# EAGLE design PowerBrickBoard (EAGLE 9.2.0)
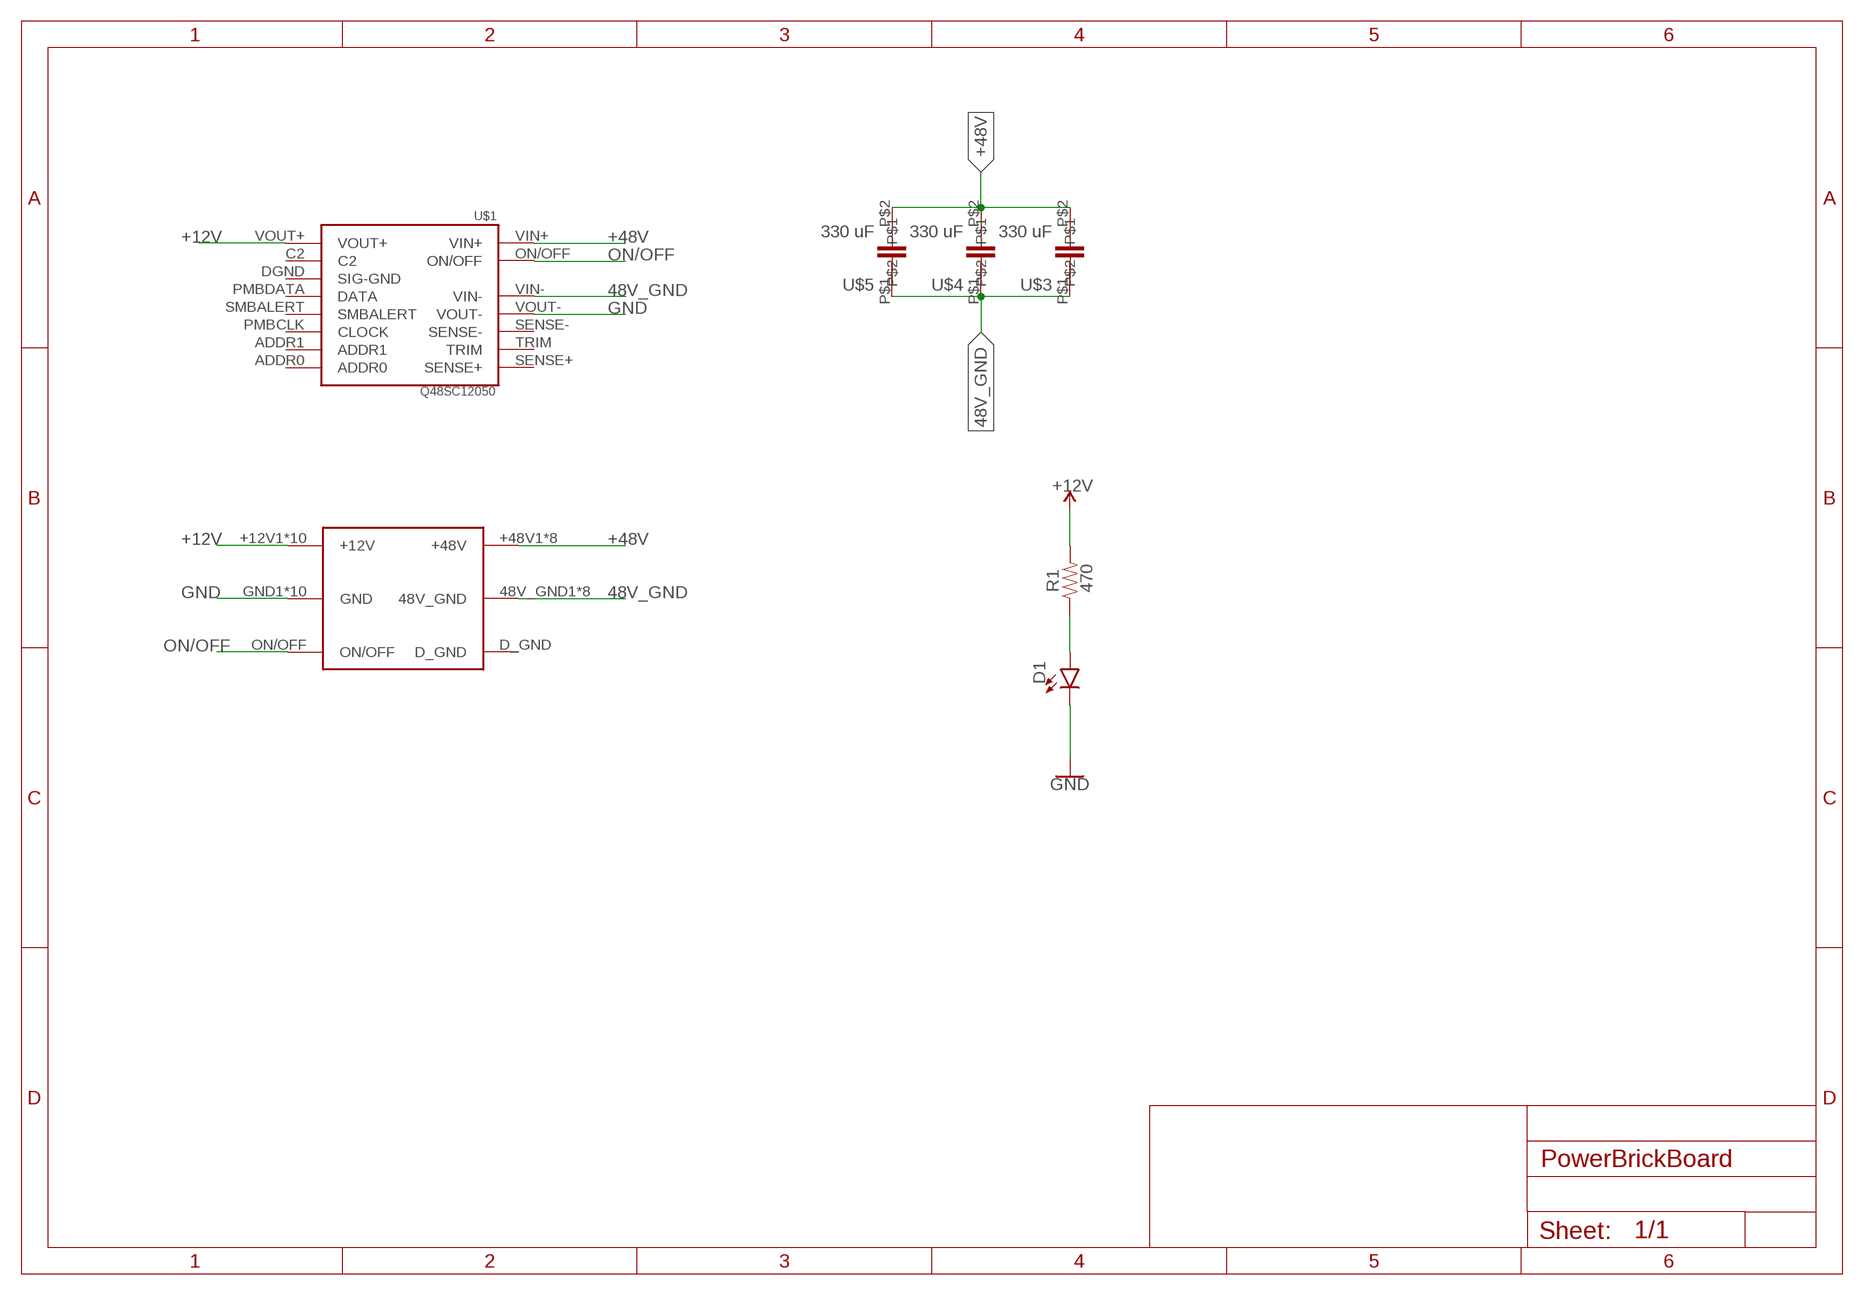
[diagram p0: schematic, sheet 1]

## Parts
D1  LED0603  [LED-0603]
R1  470  RESISTOR0603  [0603]
U$1  Q48SC12050  [Q48SC12050]
U$2  BRICK_TO_POWER_DIST_WHOLE  [BRICK_TO_POWER_DIST_WHOLE]
U$3  330 uF  UCM1H331MNL1GS  [UCM1H331MNL1GS]
U$4  330 uF  UCM1H331MNL1GS  [UCM1H331MNL1GS]
U$5  330 uF  UCM1H331MNL1GS  [UCM1H331MNL1GS]

## Nets
48V_GND: U$1.VIN- U$2.48V_GND1(48V_GND) U$2.48V_GND2(48V_GND) U$2.48V_GND3(48V_GND) U$2.48V_GND4(48V_GND) U$2.48V_GND5(48V_GND) U$2.48V_GND6(48V_GND) U$2.48V_GND7(48V_GND) U$2.48V_GND8(48V_GND) U$3.P$1 U$4.P$1 U$5.P$1
+12V: R1.2 U$1.VOUT+ U$2.+12V1(+12V) U$2.+12V2(+12V) U$2.+12V3(+12V) U$2.+12V4(+12V) U$2.+12V5(+12V) U$2.+12V6(+12V) U$2.+12V7(+12V) U$2.+12V8(+12V) U$2.+12V9(+12V) U$2.+12V10(+12V)
+48V: U$1.VIN+ U$2.+48V1(+48V) U$2.+48V2(+48V) U$2.+48V3(+48V) U$2.+48V4(+48V) U$2.+48V5(+48V) U$2.+48V6(+48V) U$2.+48V7(+48V) U$2.+48V8(+48V) U$3.P$2 U$4.P$2 U$5.P$2
D_GND: U$1.DGND(SIG-GND)
GND: D1.C U$1.VOUT- U$2.GND1(GND) U$2.GND2(GND) U$2.GND3(GND) U$2.GND4(GND) U$2.GND5(GND) U$2.GND6(GND) U$2.GND7(GND) U$2.GND8(GND) U$2.GND9(GND) U$2.GND10(GND)
N$1: D1.A R1.1
ON/OFF: U$1.ON/OFF U$2.ON/OFF
Unconnected: U$1.ADDR0 U$1.ADDR1 U$1.C2 U$1.PMBCLK(CLOCK) U$1.PMBDATA(DATA) U$1.SENSE+ U$1.SENSE- U$1.SMBALERT U$1.TRIM U$2.D_GND

## Library data of the parts
D1 = SparkFun-LED:LED: LED (Generic) Standard schematic elements and footprints for 5mm, 3mm, 1206, and 0603 sized LEDs. Generic LEDs with no color specified.
R1 = SparkFun-Resistors:RESISTOR: Generic Resistor Package
U$1 = Q48SC12050:Q48SC12050
U$2 = PDB_TO_BRICKS:BRICK_TO_POWER_DIST_WHOLE
U$3-U$5 = UCM1H331MNL1GS:UCM1H331MNL1GS

## Board
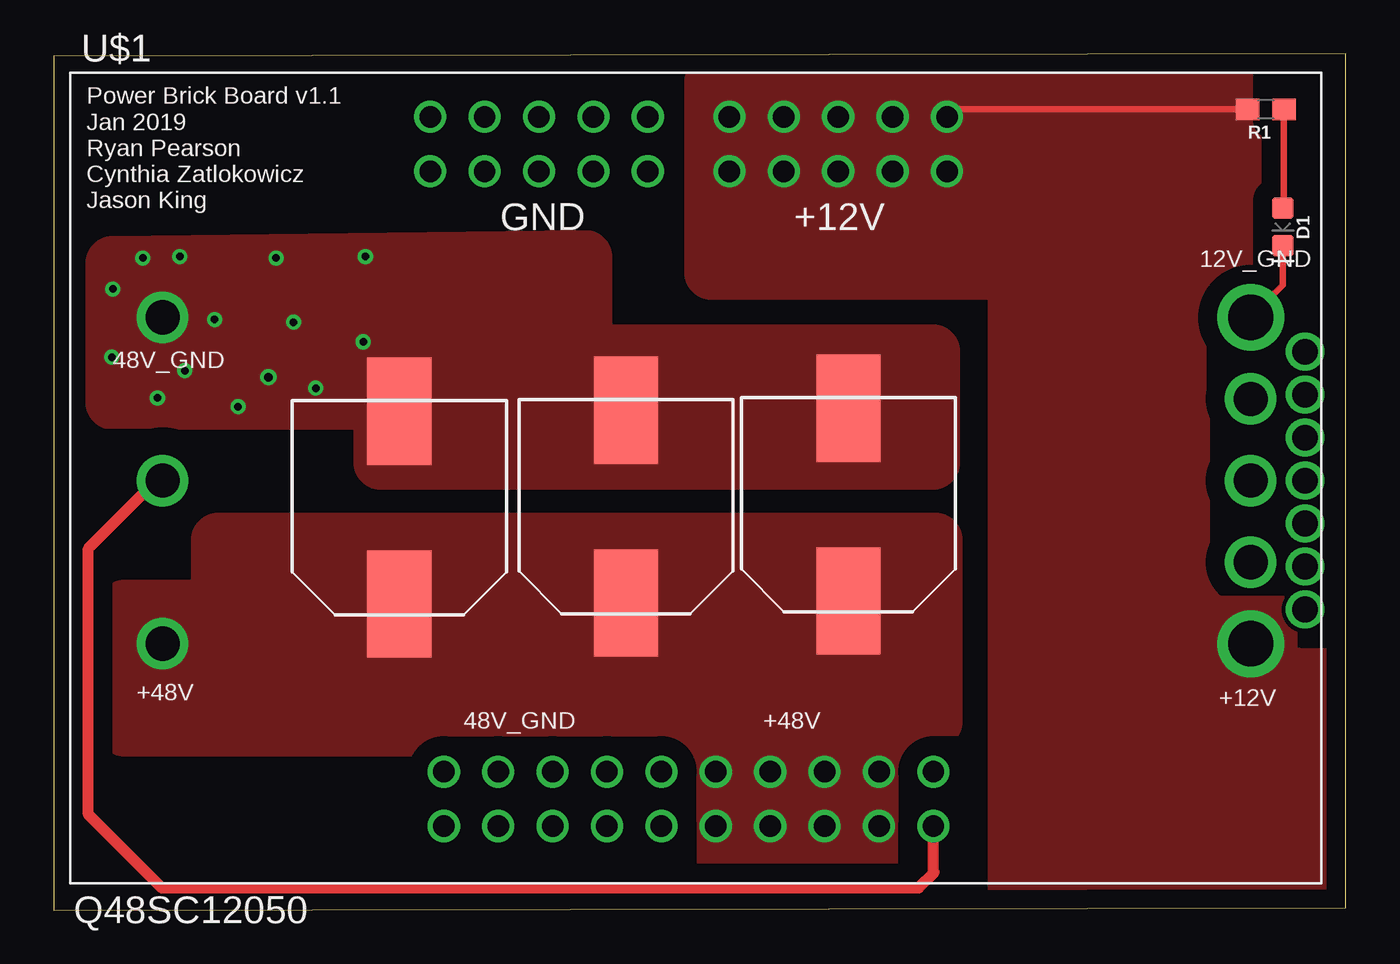
[diagram p1: board, top side]
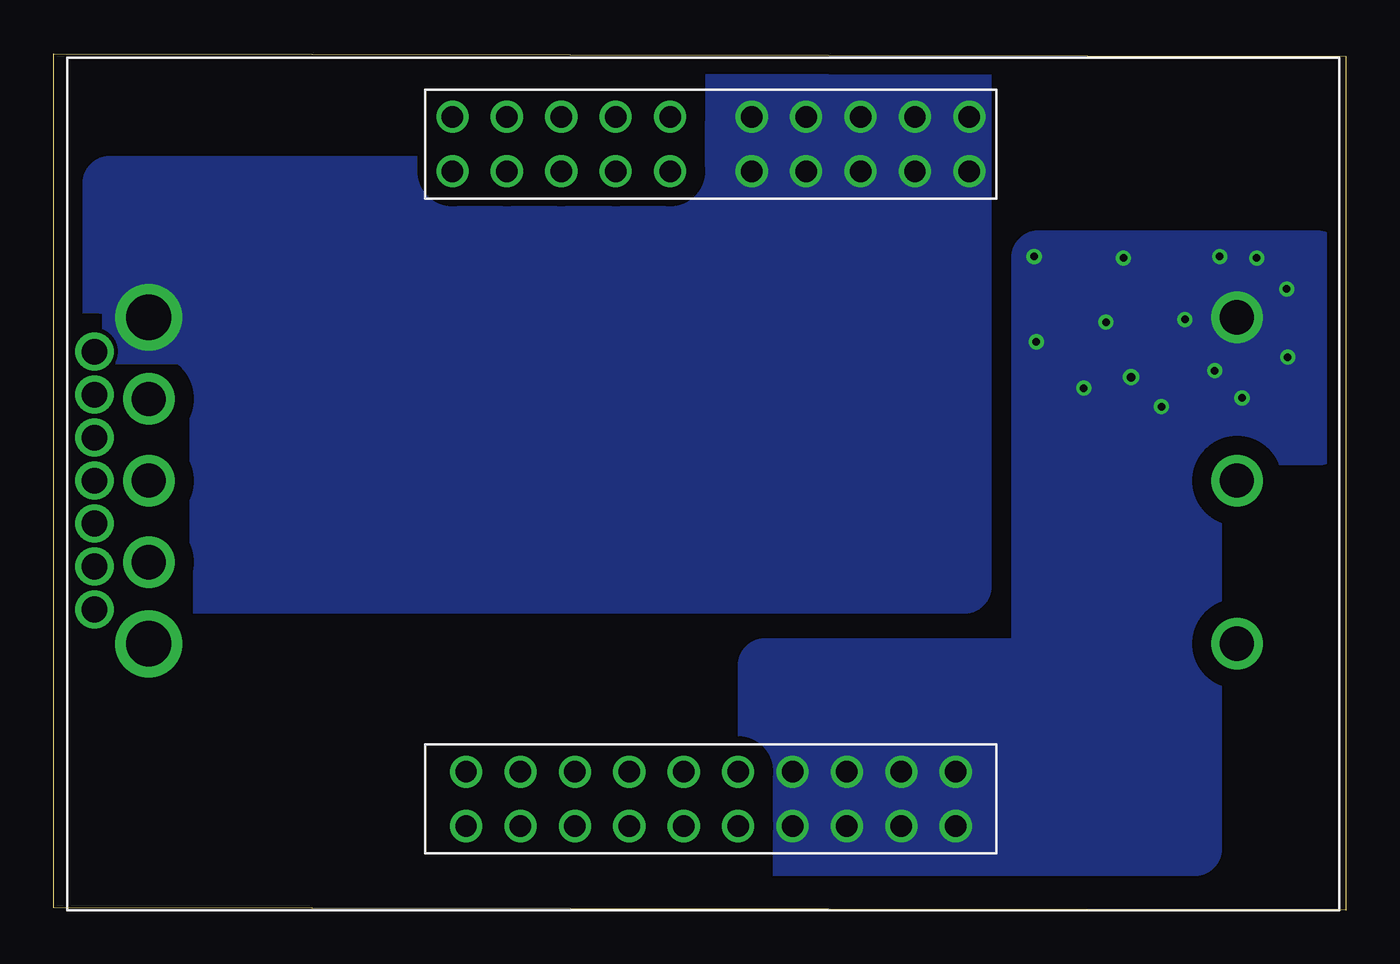
[diagram p2: board, bottom side, seen from below]

Size 60.34 x 40.01 mm. Coordinates in mm from the lower left corner, seen from the top.
Outline: 0,0 60.34,0.13 60.34,40.01 0,39.88 0,0
Copper layers (1*16): Top 0.0356mm / dielectric 1.5011mm / Bottom 0.0356mm
Design rules "ECE_Senior_Design": minimum track width 8mil, minimum drill 13mil, track to track 8mil, track to pad 8mil, pad to pad 6mil, via to via 8mil, smd to smd 6mil, copper to edge 15mil, drill to drill 8mil, minimum pad ring 7mil, minimum via ring 7mil, stop-mask expansion 3mil, vias tented up to drill 0mil, thermal gap 10mil

### Footprints (pad centres in the part's own frame; a part is rotated, then mirrored left to right if it is on the bottom)
LED-0603 = smd 1 x 1: A -0.877,0; C 0.877,0
0603 = smd 1.1 x 1: 1 -0.85,0; 2 0.85,0
Q48SC12050 = drill 1.194: ADDR0 53.34,-13.64; ADDR1 53.34,-11.633; C2 53.34,-1.6; DGND 53.34,-3.607; PMBCLK 53.34,-9.627; PMBDATA 53.34,-5.613; SMBALERT 53.34,-7.62 | drill 1.6: ON/OFF 0,-7.62; SENSE+ 50.8,-11.43; SENSE- 50.8,-3.81; TRIM 50.8,-7.62; VIN+ 0,-15.24; VIN- 0,0 | drill 2.108: VOUT+ 50.8,-15.24; VOUT- 50.8,0
BRICK_TO_POWER_DIST_WHOLE = drill 1: 48V_GND1 36.405,6.47; 48V_GND2 38.945,6.47; 48V_GND3 36.405,3.93; 48V_GND4 38.945,3.93; 48V_GND5 33.865,3.93; 48V_GND6 33.865,6.47; 48V_GND7 41.485,3.93; 48V_GND8 41.485,6.47; +12V1 17.99,37.05; +12V2 20.53,37.05; +12V3 23.07,37.05; +12V4 25.61,37.05; +12V5 28.15,37.05; +12V6 17.99,34.51; +12V7 20.53,34.51; +12V8 23.07,34.51; +12V9 25.61,34.51; +12V10 28.15,34.51; +48V1 26.245,6.47; +48V2 28.785,6.47; +48V3 26.245,3.93; +48V4 28.785,3.93; +48V5 23.705,6.47; +48V6 23.705,3.93; +48V7 21.165,3.93; +48V8 21.165,6.47; D_GND 18.625,6.47; GND1 31.96,37.05; GND2 34.5,37.05; GND3 37.04,37.05; GND4 39.58,37.05; GND5 42.12,37.05; GND6 31.96,34.51; GND7 34.5,34.51; GND8 37.04,34.51; GND9 39.58,34.51; GND10 42.12,34.51; ON/OFF 18.625,3.93; P$31 31.325,3.93; P$36 31.325,6.47
UCM1H331MNL1GS = smd 3 x 5: P$1 0,-4.5; P$2 0,4.5

### Placement (x,y rotation side)
D1  57.39,31.9 270 top
R1  56.59,37.4 180 top
U$1  5.09,27.69 0 top
U$2  59.7,0 0 bottom
U$3  37.11,18.94 180 top
U$4  26.72,18.84 180 top
U$5  16.14,18.8 180 top

### Tracks (layer width: path | path; a pad name or v marks a point on that pad's centre or on a via)
48V_GND  (via drill 0.35, 0.4)
  other vias: 10.03,24.89 7.52,27.58 11.2,27.46 14.45,26.54 12.24,24.38 8.61,23.52 6.12,25.2 4.85,23.93 2.72,25.83 2.77,29.01 4.17,30.45 5.89,30.53 10.39,30.45 14.56,30.53
  pour Top (isolate 1.27, no thermals): 2.77,23.7 15.27,23.7 15.27,20.9 41.05,20.9 41.05,26.09 24.82,26.09 24.82,30.51 2.77,30.23
  pour Bottom (isolate 0.889, no thermals): 1.37,30.48 14.35,30.48 14.35,11.43 27.13,11.43 27.13,2.87 7.06,2.87 7.06,22.02 1.37,22.02
+12V
  Top 0.305: R1.2 42.07,37.4 U$2.+12V1
  pour Top (isolate 0.889, no thermals): 30.71,38.66 57.84,38.66 57.84,15.04 59.11,15.04 59.11,0.89 44.88,0.89 44.88,29.77 30.71,29.77
  pour Top (isolate 0.203, no thermals): 53.82,14.61 57.99,14.61 57.99,10.11 53.82,10.11
+48V
  pour Top (isolate 0.889, no thermals): 3.33,14.17 7.7,14.17 7.7,17.3 41.17,17.3 41.17,8.81 39.5,8.81 39.5,2.82 29.69,2.82 29.69,8.46 3.33,8.46
GND
  Top 0.305: D1.C 57.39,29.18 U$1.VOUT-
  pour Bottom (isolate 0.889, no thermals): 17.81,38.91 29.49,38.91 29.49,33.96 57.71,33.96 57.71,15.11 17.81,15.11
  pour Bottom (no thermals): 53.21,25.58 53.21,29.79 57.99,29.79 57.99,25.58
N$1
  Top 0.305: R1.1 57.44,32.83 D1.A
ON/OFF
  Top 0.508: U$1.ON/OFF 4.8,20.07 1.63,16.89 1.63,4.47 5.06,1.04 40.39,1.04 41.12,1.78 41.08,1.82 U$2.ON/OFF

### Text on the board
tPlace: Power Brick Board v1.1 / Jan 2019 / Ryan Pearson / Cynthia Zatlokowicz / Jason King | GND | +12V | 12V_GND | 48V_GND | +48V | +12V | 48V_GND | +48V